# EAGLE schematic supercap (EAGLE 8.6.0)
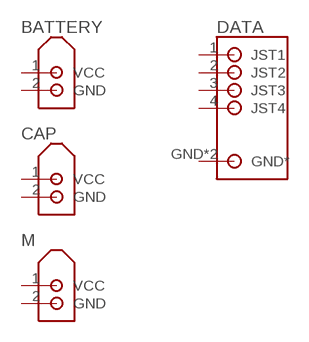
[diagram p0: schematic, sheet 1]

## Parts
BATTERY  XT60  [XT60]
CAP  XT60  [XT60]
DATA  S4B-PH-SM4_TB  [S4B-PH-SM4_TB]
M  XT60  [XT60]
Unconnected: BATTERY.1(VCC) BATTERY.2(GND) CAP.1(VCC) CAP.2(GND) DATA.1(JST1) DATA.2(JST2) DATA.3(JST3) DATA.4(JST4) DATA.GND2(GND*) DATA.GND(GND*) M.1(VCC) M.2(GND)

## Library data of the parts
BATTERY CAP M = KevinMade:XT60
DATA = KevinMade:S4B-PH-SM4_TB